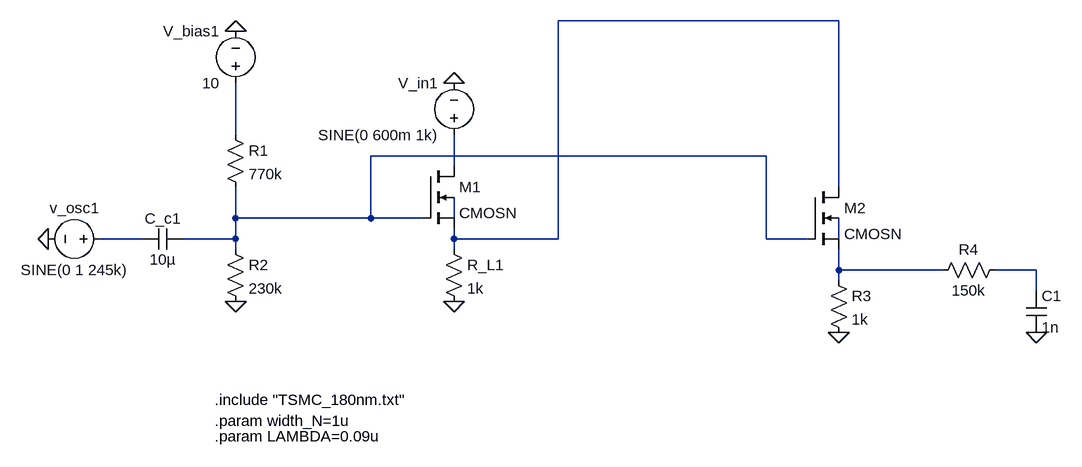
[diagram p0: schematic mod_demod_combined.asc]
mod_demod_combined.asc, the LTspice schematic file:
Version 4
SHEET 1 1160 680
WIRE 816 -240 384 -240
WIRE -112 -64 -112 -144
WIRE 704 -32 96 -32
WIRE 224 -16 224 -64
WIRE 816 16 816 -240
WIRE -112 64 -112 16
WIRE 96 64 96 -32
WIRE 96 64 -112 64
WIRE 176 64 96 64
WIRE 224 64 224 32
WIRE -256 96 -320 96
WIRE -112 96 -112 64
WIRE -112 96 -192 96
WIRE 224 96 224 80
WIRE 384 96 384 -240
WIRE 384 96 224 96
WIRE 704 96 704 -32
WIRE 768 96 704 96
WIRE 816 96 816 64
WIRE -112 112 -112 96
WIRE 224 112 224 96
WIRE 816 144 816 112
WIRE 976 144 816 144
WIRE 1120 144 1056 144
WIRE 816 160 816 144
WIRE 1120 176 1120 144
FLAG -112 192 0
FLAG -400 96 0
FLAG -112 -224 0
FLAG 224 -144 0
FLAG 224 192 0
FLAG 816 240 0
FLAG 1120 240 0
SYMBOL nmos4 176 -16 R0
SYMATTR InstName M1
SYMATTR Value CMOSN
SYMATTR Value2 l={2*LAMBDA} w={width_N} ad={5*width_ N*LAMBDA} as={5*width_ N*LAMBDA} pd={10*LAMBDA+2*width_N} ps={10*LAMBDA+2*width_N}
SYMBOL res -128 -80 R0
SYMATTR InstName R1
SYMATTR Value 770k
SYMBOL res -128 96 R0
SYMATTR InstName R2
SYMATTR Value 230k
SYMBOL cap -192 80 R90
WINDOW 0 0 32 VBottom 2
WINDOW 3 32 32 VTop 2
SYMATTR InstName C_c1
SYMATTR Value 10µ
SYMBOL voltage -304 96 R90
WINDOW 0 -32 56 VBottom 2
WINDOW 3 32 56 VTop 2
WINDOW 123 0 0 Left 0
WINDOW 39 0 0 Left 0
SYMATTR InstName v_osc1
SYMATTR Value SINE(0 1 245k)
SYMBOL voltage -112 -128 R180
WINDOW 0 24 96 Left 2
WINDOW 3 24 16 Left 2
SYMATTR InstName V_bias1
SYMATTR Value 10
SYMBOL voltage 224 -48 R180
WINDOW 0 24 96 Left 2
WINDOW 3 24 16 Left 2
WINDOW 123 0 0 Left 0
WINDOW 39 0 0 Left 0
SYMATTR InstName V_in1
SYMATTR Value SINE(0 600m 1k)
SYMBOL res 208 96 R0
SYMATTR InstName R_L1
SYMATTR Value 1k
SYMBOL nmos4 768 16 R0
SYMATTR InstName M2
SYMATTR Value CMOSN
SYMATTR Value2 l={2*LAMBDA} w={width_N} ad={5*width_ N*LAMBDA} as={5*width_ N*LAMBDA} pd={10*LAMBDA+2*width_N} ps={10*LAMBDA+2*width_N}
SYMBOL res 800 144 R0
SYMATTR InstName R3
SYMATTR Value 1k
SYMBOL res 1072 128 R90
WINDOW 0 0 56 VBottom 2
WINDOW 3 32 56 VTop 2
SYMATTR InstName R4
SYMATTR Value 150k
SYMBOL cap 1104 176 R0
SYMATTR InstName C1
SYMATTR Value 1n
TEXT -144 344 Left 2 !.include "TSMC_180nm.txt"
TEXT -144 376 Left 2 !.param width_N=1u
TEXT -144 400 Left 2 !.param LAMBDA=0.09u

The netlist it stands for:
* mod_demod_combined.asc
M1 N004 N003 N001 N005 CMOSN l={2*LAMBDA} w={width_N} ad={5*width_ N*LAMBDA} as={5*width_ N*LAMBDA} pd={10*LAMBDA+2*width_N} ps={10*LAMBDA+2*width_N}
R1 N002 N003 770k
R2 N003 0 230k
C_c1 N003 N006 10µ
v_osc1 N006 0 SINE(0 1 245k)
V_bias1 N002 0 10
V_in1 N004 0 SINE(0 600m 1k)
R_L1 N001 0 1k
M2 N001 N003 N008 N007 CMOSN l={2*LAMBDA} w={width_N} ad={5*width_ N*LAMBDA} as={5*width_ N*LAMBDA} pd={10*LAMBDA+2*width_N} ps={10*LAMBDA+2*width_N}
R3 N008 0 1k
R4 N009 N008 150k
C1 N009 0 1n
.model NMOS NMOS
.model PMOS PMOS
.lib standard.mos
.include "TSMC_180nm.txt"
.param width_N=1u
.param LAMBDA=0.09u
.backanno
.end